# Altium schematic sheet inventer.SchDoc
size A4; SheetNumber: 1; SheetTotal: 5
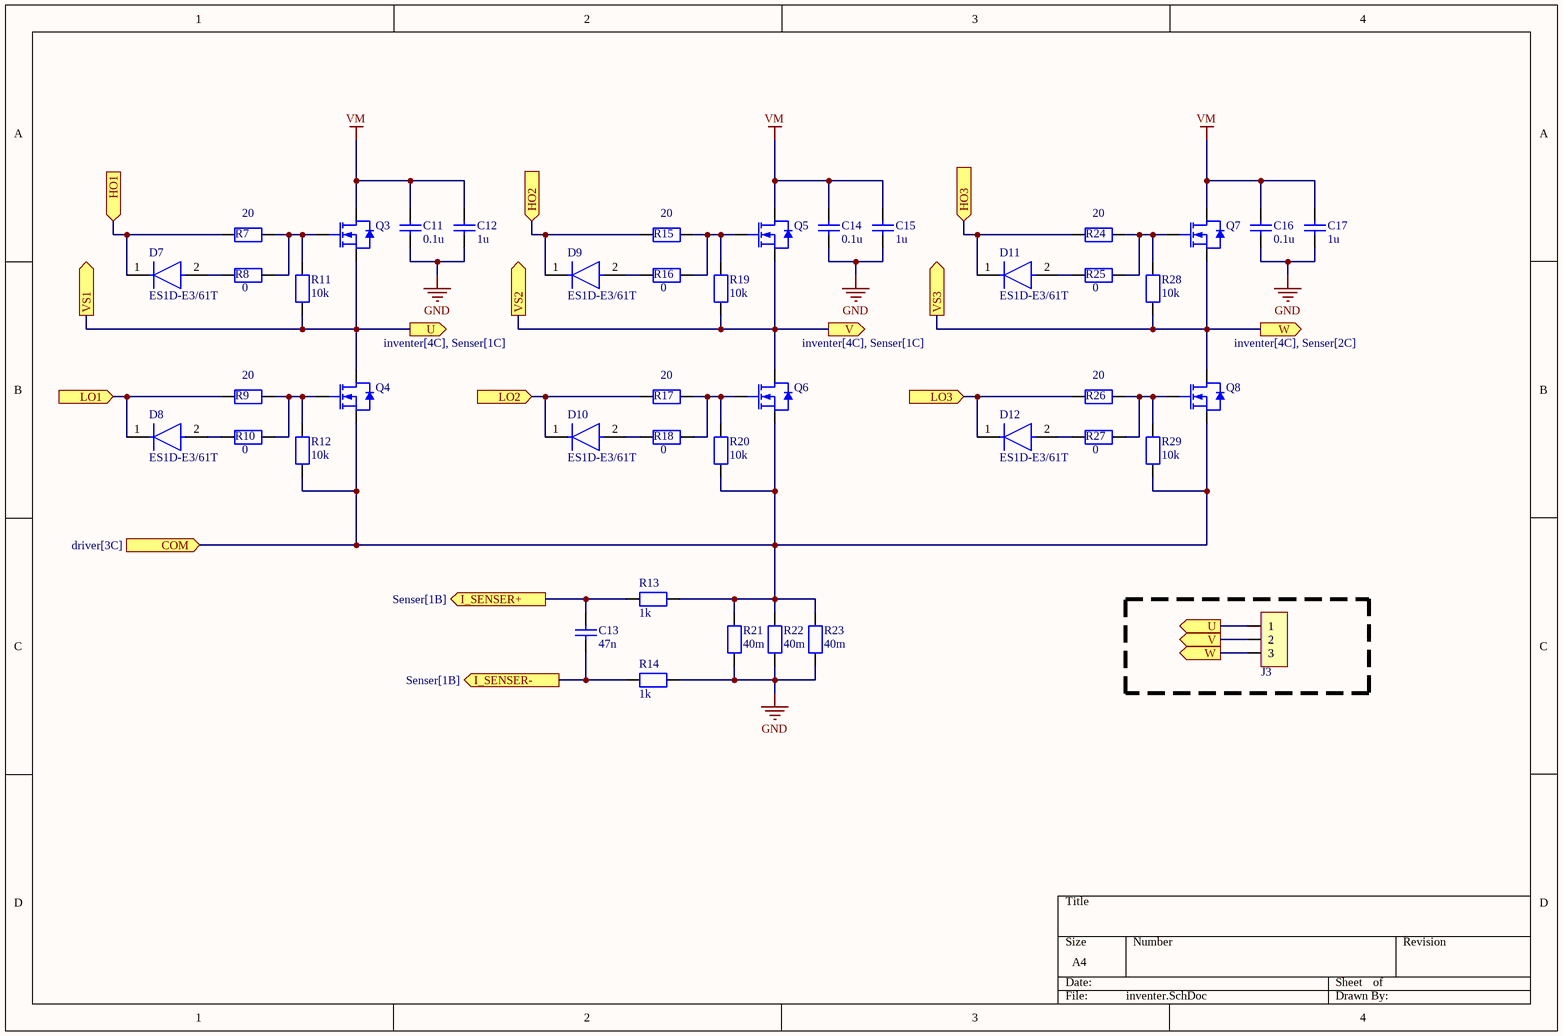
[diagram p0: inventer.SchDoc]

## Parts
C11  value 0.1u  [CAP_1206]  (hidden comment: CAP)
C12  value 1u  [CAP_1206]  (hidden comment: CAP)
C13  value 47n  [CAPC2012X06N]  (hidden comment: CAP)
C14  value 0.1u  [CAP_1206]  (hidden comment: CAP)
C15  value 1u  [CAP_1206]  (hidden comment: CAP)
C16  value 0.1u  [CAP_1206]  (hidden comment: CAP)
C17  value 1u  [CAP_1206]  (hidden comment: CAP)
D7  ES1D-E3/61T  [FP-95400-MFG]
D8  ES1D-E3/61T  [FP-95400-MFG]
D9  ES1D-E3/61T  [FP-95400-MFG]
D10  ES1D-E3/61T  [FP-95400-MFG]
D11  ES1D-E3/61T  [FP-95400-MFG]
D12  ES1D-E3/61T  [FP-95400-MFG]
J3  Power 3  [Power 3]  (value not drawn)
Q3  IRF1010ZSTRLPBF  [FP-PG-TO263-3-MFG]  (value not drawn)
Q4  IRF1010ZSTRLPBF  [FP-PG-TO263-3-MFG]  (value not drawn)
Q5  IRF1010ZSTRLPBF  [FP-PG-TO263-3-MFG]  (value not drawn)
Q6  IRF1010ZSTRLPBF  [FP-PG-TO263-3-MFG]  (value not drawn)
Q7  IRF1010ZSTRLPBF  [FP-PG-TO263-3-MFG]  (value not drawn)
Q8  IRF1010ZSTRLPBF  [FP-PG-TO263-3-MFG]  (value not drawn)
R7  value 20  [RESC3016X06N]  (hidden comment: 1k)
R8  value 0  [RESC3016X06N]  (hidden comment: 1k)
R9  value 20  [RESC3016X06N]  (hidden comment: 1k)
R10  value 0  [RESC3016X06N]  (hidden comment: 1k)
R11  10k  [RESC2012X06N]
R12  10k  [RESC2012X06N]
R13  value 1k  [RESC2012X06N]  (hidden comment: Resistor)
R14  value 1k  [RESC2012X06N]  (hidden comment: Resistor)
R15  value 20  [RESC3016X06N]  (hidden comment: 1k)
R16  value 0  [RESC3016X06N]  (hidden comment: 1k)
R17  value 20  [RESC3016X06N]  (hidden comment: 1k)
R18  value 0  [RESC3016X06N]  (hidden comment: 1k)
R19  10k  [RESC2012X06N]
R20  10k  [RESC2012X06N]
R21  value 40m  [RESC2512]  (hidden comment: Resistor)
R22  value 40m  [RESC2512]  (hidden comment: Resistor)
R23  value 40m  [RESC2512]  (hidden comment: Resistor)
R24  value 20  [RESC3016X06N]  (hidden comment: 1k)
R25  value 0  [RESC3016X06N]  (hidden comment: 1k)
R26  value 20  [RESC3016X06N]  (hidden comment: 1k)
R27  value 0  [RESC3016X06N]  (hidden comment: 1k)
R28  10k  [RESC2012X06N]
R29  10k  [RESC2012X06N]

## Ports
COM (in, see driver[3C]), HO1 (in, see driver[2A]), HO2 (in, see driver[4A]), HO3 (in, see driver[2C]), I_SENSER+ (out, see Senser[1B]), I_SENSER- (out, see Senser[1B]), LO1 (in, see driver[2B]), LO2 (in, see driver[4B]), LO3 (in, see driver[2C]), U (out, see inventer[2B], Senser[1C]), U (out, see inventer[4C], Senser[1C]), V (out, see inventer[3B], Senser[1C]), V (out, see inventer[4C], Senser[1C]), VS1 (out, see driver[2A]), VS2 (out, see driver[4A]), VS3 (out, see driver[2C]), W (out, see inventer[4B], Senser[2C]), W (out, see inventer[4C], Senser[2C])

## Nets
GND: C11.2 C12.2 C14.2 C15.2 C16.2 C17.2 R14.1 R21.1 R22.1 R23.1
VM: C11.1 C12.1 C14.1 C15.1 C16.1 C17.1 Q3.D Q5.D Q7.D
COM: Q4.S Q6.S Q8.S R12.1 R13.1 R20.1 R21.2 R22.2 R23.2 R29.1 ; port COM
HO1: D7.1(C) R7.1 ; port HO1
HO2: D9.1(C) R15.1 ; port HO2
HO3: D11.1(C) R24.1 ; port HO3
I_SENSER+: C13.1 R13.2 ; port I_SENSER+
I_SENSER-: C13.2 R14.2 ; port I_SENSER-
LO1: D8.1(C) R9.1 ; port LO1
LO2: D10.1(C) R17.1 ; port LO2
LO3: D12.1(C) R26.1 ; port LO3
U: J3.1 Q3.S Q4.D R11.1 ; port VS1, port U
V: J3.2 Q5.S Q6.D R19.1 ; port VS2, port V
VS3: J3.3 Q7.S Q8.D R28.1 ; port VS3, port W
NetD7_2: D7.2(A) R8.1
NetD8_2: D8.2(A) R10.1
NetD9_2: D9.2(A) R16.1
NetD10_2: D10.2(A) R18.1
NetD11_2: D11.2(A) R25.1
NetD12_2: D12.2(A) R27.1
NetQ3_G: Q3.G R7.2 R8.2 R11.2
NetQ4_G: Q4.G R9.2 R10.2 R12.2
NetQ5_G: Q5.G R15.2 R16.2 R19.2
NetQ6_G: Q6.G R17.2 R18.2 R20.2
NetQ7_G: Q7.G R24.2 R25.2 R28.2
NetQ8_G: Q8.G R26.2 R27.2 R29.2

## Library data of the parts
C11 C14 C16 = CAP: Конденсатор керамический smd 0.1 мкФ X7R 50В 10% 1206,; Source: *
C12 C15 C17 = CAP: Конденсатор керамический smd 1 мкФ X7R 50В,10%, 1206; Source: *
C13 = CAP: Конденсатор керамический smd 0.047мкФ X7R 50В 10% 0805; Source: *
D7-D12 = CMP-02540-000037-1: DIODE GEN PURP 200V 1A DO214AC; Manufacturer: Vishay; Standoff Height: 0mm; Peak Reverse Current: 5uA; Value: 10 pF; Max Surge Forward Current: 30A; Max Junction Temp: +150°C; Device Class L3: Rectifier Diodes; RoHS: TRUE; Device Class L1: Discrete Semiconductors; Lead Free: Yes; ComponentLink2Description: Datasheet; Digikey Description: DIODE GEN PURP 200V 1A DO214AC; Device Class L2: Diodes; Package: 95400; Max Repetitive Reverse Voltage: 200V; Footprint Url: http://www.vishay.com/docs/95400/sma.pdf; Temperature Range High: +150°C; ComponentLink2URL: http://www.vishay.com/docs/88586/es1.pdf; Automotive: No; Octopart: https://octopart.com/es1d-e3%2F61t-vishay-39550266; Manufacturer Part Number: ES1D-E3/61T; Temperature: -55°C to +150°C; Category: Diode; Temperature Range Low: -55°C; Height: 2.29mm; Capacitance: 10 pF; Mouser Description: Ultrafast Rectifier, Plastic Surface Mount, 1 A, 200 VDC, DO0214AC (SMA), RoHS; Forward Current: 1A
Q3-Q8 = NMOS: IRF1010ZSTRLPBF, Транзистор HEXFET N-канал 55В 75А; Source: https://www.chipdip.ru/product/irf1010zstrlpbf-infineon
R7 R9 R15 R17 R24 R26 = Resistor: 0.25Вт 1206 20 Ом, 1%; Source: *
R8 R10 R16 R18 R25 R27 = Resistor: 0.25Вт 1206 (перемычка) 0 Ом; Source: *
R11 R12 R19 R20 R28 R29 = Resistor: 0.125Вт 0805 10 кОм, 1%; Value: 10k; Source: *
R13 R14 = Resistor: 0.125Вт 0805 1 кОм, 1%; Source: *
R21-R23 = Resistor: Source: *